# Altium schematic sheet DM_V1_FPGA.SchDoc
size Letter
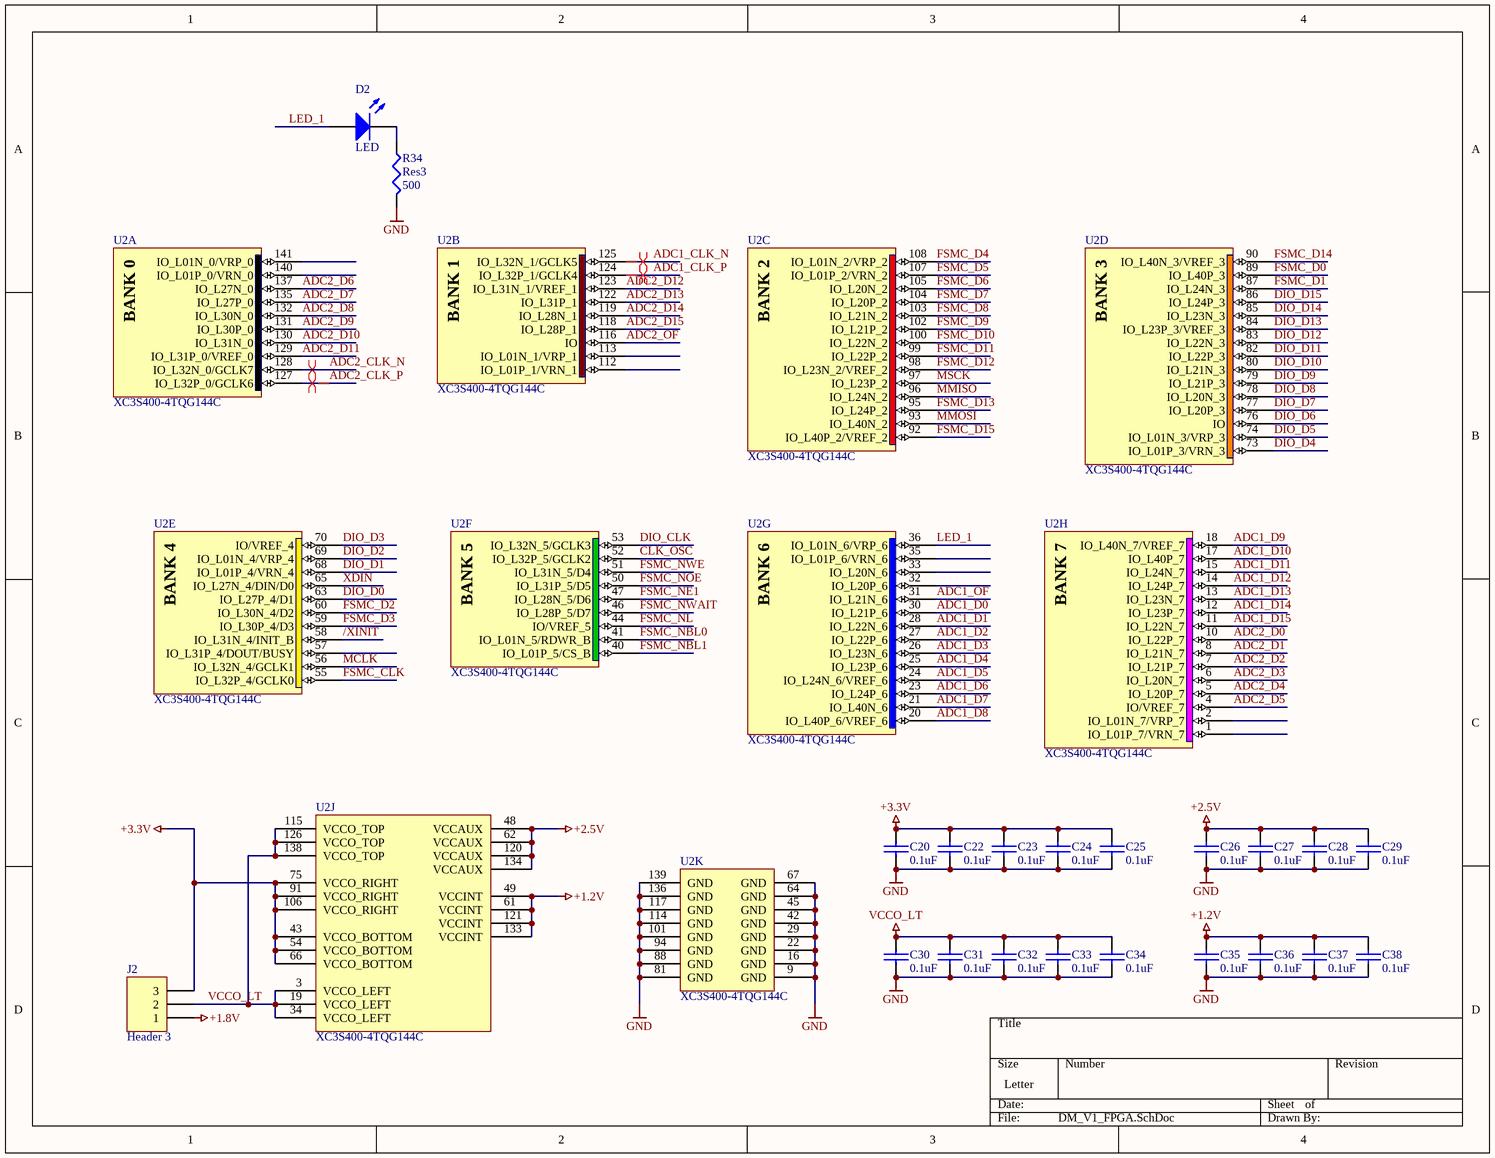
[diagram p0: DM_V1_FPGA.SchDoc]

## Parts
C20  value 0.1uF  [1608[0603]]  (hidden comment: 0.1)
C22  value 0.1uF  [1608[0603]]  (hidden comment: 0.1)
C23  value 0.1uF  [1608[0603]]  (hidden comment: 0.1)
C24  value 0.1uF  [1608[0603]]  (hidden comment: 0.1)
C25  value 0.1uF  [1608[0603]]  (hidden comment: 0.1)
C26  value 0.1uF  [1608[0603]]  (hidden comment: 0.1)
C27  value 0.1uF  [1608[0603]]  (hidden comment: 0.1)
C28  value 0.1uF  [1608[0603]]  (hidden comment: 0.1)
C29  value 0.1uF  [1608[0603]]  (hidden comment: 0.1)
C30  value 0.1uF  [1608[0603]]  (hidden comment: 0.1)
C31  value 0.1uF  [1608[0603]]  (hidden comment: 0.1)
C32  value 0.1uF  [1608[0603]]  (hidden comment: 0.1)
C33  value 0.1uF  [1608[0603]]  (hidden comment: 0.1)
C34  value 0.1uF  [1608[0603]]  (hidden comment: 0.1)
C35  value 0.1uF  [1608[0603]]  (hidden comment: 0.1)
C36  value 0.1uF  [1608[0603]]  (hidden comment: 0.1)
C37  value 0.1uF  [1608[0603]]  (hidden comment: 0.1)
C38  value 0.1uF  [1608[0603]]  (hidden comment: 0.1)
D2  LED  [1608[0603]]
J2  Header 3  [HDR1X3]
R34  Res3  value 500  [J1-0603]
U2  XC3S400-4TQG144C  [TQG144_N]  (parts A,B,C,D,E,F,G,H,J,K of 11)

## Nets
+1.2V: C35.2 C36.2 C37.2 C38.2 U2.49(VCCINT) U2.61(VCCINT) U2.121(VCCINT) U2.133(VCCINT)
+1.8V: J2.1
+2.5V: C26.2 C27.2 C28.2 C29.2 U2.48(VCCAUX) U2.62(VCCAUX) U2.120(VCCAUX) U2.134(VCCAUX)
+3.3V: C20.2 C22.2 C23.2 C24.2 C25.2 J2.3 U2.43(VCCO_BOTTOM) U2.54(VCCO_BOTTOM) U2.66(VCCO_BOTTOM) U2.75(VCCO_RIGHT) U2.91(VCCO_RIGHT) U2.106(VCCO_RIGHT)
GND: C20.1 C22.1 C23.1 C24.1 C25.1 C26.1 C27.1 C28.1 C29.1 C30.1 C31.1 C32.1 C33.1 C34.1 C35.1 C36.1 C37.1 C38.1 R34.2 U2.9(GND) U2.16(GND) U2.22(GND) U2.29(GND) U2.42(GND) U2.45(GND) U2.64(GND) U2.67(GND) U2.81(GND) U2.88(GND) U2.94(GND) U2.101(GND) U2.114(GND) U2.117(GND) U2.136(GND) U2.139(GND)
VCCO_LT: C30.2 C31.2 C32.2 C33.2 C34.2 J2.2 U2.3(VCCO_LEFT) U2.19(VCCO_LEFT) U2.34(VCCO_LEFT) U2.115(VCCO_TOP) U2.126(VCCO_TOP) U2.138(VCCO_TOP)
/XINIT: U2.58(IO_L31N_4/INIT_B)
ADC1_CLK_N: U2.125(IO_L32N_1/GCLK5)
ADC1_CLK_P: U2.124(IO_L32P_1/GCLK4)
ADC1_D0: U2.30(IO_L21P_6)
ADC1_D1: U2.28(IO_L22N_6)
ADC1_D2: U2.27(IO_L22P_6)
ADC1_D3: U2.26(IO_L23N_6)
ADC1_D4: U2.25(IO_L23P_6)
ADC1_D5: U2.24(IO_L24N_6/VREF_6)
ADC1_D6: U2.23(IO_L24P_6)
ADC1_D7: U2.21(IO_L40N_6)
ADC1_D8: U2.20(IO_L40P_6/VREF_6)
ADC1_D9: U2.18(IO_L40N_7/VREF_7)
ADC1_D10: U2.17(IO_L40P_7)
ADC1_D11: U2.15(IO_L24N_7)
ADC1_D12: U2.14(IO_L24P_7)
ADC1_D13: U2.13(IO_L23N_7)
ADC1_D14: U2.12(IO_L23P_7)
ADC1_D15: U2.11(IO_L22N_7)
ADC1_OF: U2.31(IO_L21N_6)
ADC2_CLK_N: U2.128(IO_L32N_0/GCLK7)
ADC2_CLK_P: U2.127(IO_L32P_0/GCLK6)
ADC2_D0: U2.10(IO_L22P_7)
ADC2_D1: U2.8(IO_L21N_7)
ADC2_D2: U2.7(IO_L21P_7)
ADC2_D3: U2.6(IO_L20N_7)
ADC2_D4: U2.5(IO_L20P_7)
ADC2_D5: U2.4(IO/VREF_7)
ADC2_D6: U2.137(IO_L27N_0)
ADC2_D7: U2.135(IO_L27P_0)
ADC2_D8: U2.132(IO_L30N_0)
ADC2_D9: U2.131(IO_L30P_0)
ADC2_D10: U2.130(IO_L31N_0)
ADC2_D11: U2.129(IO_L31P_0/VREF_0)
ADC2_D12: U2.123(IO_L31N_1/VREF_1)
ADC2_D13: U2.122(IO_L31P_1)
ADC2_D14: U2.119(IO_L28N_1)
ADC2_D15: U2.118(IO_L28P_1)
ADC2_OF: U2.116(IO)
CLK_OSC: U2.52(IO_L32P_5/GCLK2)
DIO_CLK: U2.53(IO_L32N_5/GCLK3)
DIO_D0: U2.63(IO_L27P_4/D1)
DIO_D1: U2.68(IO_L01P_4/VRN_4)
DIO_D2: U2.69(IO_L01N_4/VRP_4)
DIO_D3: U2.70(IO/VREF_4)
DIO_D4: U2.73(IO_L01P_3/VRN_3)
DIO_D5: U2.74(IO_L01N_3/VRP_3)
DIO_D6: U2.76(IO)
DIO_D7: U2.77(IO_L20P_3)
DIO_D8: U2.78(IO_L20N_3)
DIO_D9: U2.79(IO_L21P_3)
DIO_D10: U2.80(IO_L21N_3)
DIO_D11: U2.82(IO_L22P_3)
DIO_D12: U2.83(IO_L22N_3)
DIO_D13: U2.84(IO_L23P_3/VREF_3)
DIO_D14: U2.85(IO_L23N_3)
DIO_D15: U2.86(IO_L24P_3)
FSMC_CLK: U2.55(IO_L32P_4/GCLK0)
FSMC_D0: U2.89(IO_L40P_3)
FSMC_D1: U2.87(IO_L24N_3)
FSMC_D2: U2.60(IO_L30N_4/D2)
FSMC_D3: U2.59(IO_L30P_4/D3)
FSMC_D4: U2.108(IO_L01N_2/VRP_2)
FSMC_D5: U2.107(IO_L01P_2/VRN_2)
FSMC_D6: U2.105(IO_L20N_2)
FSMC_D7: U2.104(IO_L20P_2)
FSMC_D8: U2.103(IO_L21N_2)
FSMC_D9: U2.102(IO_L21P_2)
FSMC_D10: U2.100(IO_L22N_2)
FSMC_D11: U2.99(IO_L22P_2)
FSMC_D12: U2.98(IO_L23N_2/VREF_2)
FSMC_D13: U2.95(IO_L24P_2)
FSMC_D14: U2.90(IO_L40N_3/VREF_3)
FSMC_D15: U2.92(IO_L40P_2/VREF_2)
FSMC_NBL0: U2.41(IO_L01N_5/RDWR_B)
FSMC_NBL1: U2.40(IO_L01P_5/CS_B)
FSMC_NE1: U2.47(IO_L28N_5/D6)
FSMC_NL: U2.44(IO/VREF_5)
FSMC_NOE: U2.50(IO_L31P_5/D5)
FSMC_NWAIT: U2.46(IO_L28P_5/D7)
FSMC_NWE: U2.51(IO_L31N_5/D4)
LED_1: D2.1(A) U2.36(IO_L01N_6/VRP_6)
MCLK: U2.56(IO_L32N_4/GCLK1)
MMISO: U2.96(IO_L24N_2)
MMOSI: U2.93(IO_L40N_2)
MSCK: U2.97(IO_L23P_2)
XDIN: U2.65(IO_L27N_4/DIN/D0)
NetD2_2: D2.2(K) R34.1

Not connected (* = marked no-connect by the designer): U2 1(IO_L01P_7/VRN_7) 2(IO_L01N_7/VRP_7) 32(IO_L20P_6) 33(IO_L20N_6) 35(IO_L01P_6/VRN_6) 57(IO_L31P_4/DOUT/BUSY) 112(IO_L01P_1/VRN_1) 113(IO_L01N_1/VRP_1) 140(IO_L01P_0/VRN_0) 141(IO_L01N_0/VRP_0)

## Layout directives
differential pair: ADC1_CLK_N, ADC1_CLK_P, ADC2_CLK_N, ADC2_CLK_P

## Notes on the sheet
- (in symbol XC3S400-4TQG144C, part A) BANK 0
- (in symbol XC3S400-4TQG144C, part B) BANK 1
- (in symbol XC3S400-4TQG144C, part C) BANK 2
- (in symbol XC3S400-4TQG144C, part D) BANK 3
- (in symbol XC3S400-4TQG144C, part E) BANK 4
- (in symbol XC3S400-4TQG144C, part F) BANK 5
- (in symbol XC3S400-4TQG144C, part G) BANK 6
- (in symbol XC3S400-4TQG144C, part H) BANK 7

## Library data of the parts
C20 C22-C38 = CC0603-0.1MKF X7R: Ceramic Chip-capacitor 0603; Name: Чип-конденсатор 0603-0.1 мкФ X7R; Dielectric: X7R; Voltage: 25; Vendor1: KEMET Electronics Corporation, USA; Vendor2: Samsung, Korea; Vendor3: AVX Corporation; Vendor1Name: C0603C104K3RAC; Vendor2Name: CL10B104KA8NNNC; Vendor3Name: 06033C104KAT2A; Ta: -55+125; Type: Capacitor
D2 = LED2: Typical RED, GREEN, YELLOW, AMBER GaAs LED; Published: 8-Jun-2000; LatestRevisionDate: 17-Jul-2002; LatestRevisionNote: Re-released for DXP Platform.; PackageVersion: Feb-2002; PackageReference: 3.2X1.6X1.1; Publisher: Altium Limited; PackageDescription: SM LED; 2 Flat Leads
J2 = Header 3: Header, 3-Pin; LatestRevisionDate: 17-Jul-2002; LatestRevisionNote: Re-released for DXP Platform.; Publisher: Altium Limited
R34 = Res3: Resistor; Published: 8-Jun-2000; LatestRevisionDate: 29-May-2009; LatestRevisionNote: IPC-7351 Footprint Added.; PackageReference: J1-0603; Publisher: Altium Limited; PackageDescription: Chip Resistor
U2 = XC3S400-4TQG144C: Spartan-3 1.2V FPGA, 97 User I/Os, 144-Pin TQFP, Standard Performance, Commercial Grade, Pb-Free; OrderingInformation: Additional code may have to be appended for different mask revision devices.; Published: 16-Dec-2005; LatestRevisionDate: 01-Mar-2010; LatestRevisionNote: Updated to datasheet version 2.5 Dec-2009.; DatasheetVersion: ver2.5, Dec-2009; PackageVersion: ver1.2, Jun-2004; PackageReference: TQG144; Publisher: Altium Limited; PackageDescription: 144-Pin Thin Quad Flat Pack (TQG144) - Pb-Free; Supplier 1: Digi-Key; Supplier Part Number 1: XC3S400-4TQG144C-ND; Code_JEDEC: MS-026-BFB; ComponentLink1Description: Spartan-3 Datasheet; ComponentLink1URL: http://www.xilinx.com/support/documentation/data_sheets/ds099.pdf; ComponentLink2Description: TQG144 Package Drawing; ComponentLink2URL: http://www.xilinx.com/support/documentation/package_specs/tq144.pdf; ComponentLink3Description: Spartan-3 Documents; ComponentLink3URL: http://www.xilinx.com/support/documentation/spartan-3.htm; ComponentLink4Description: Xilinx.com Home; ComponentLink4URL: http://www.xilinx.com